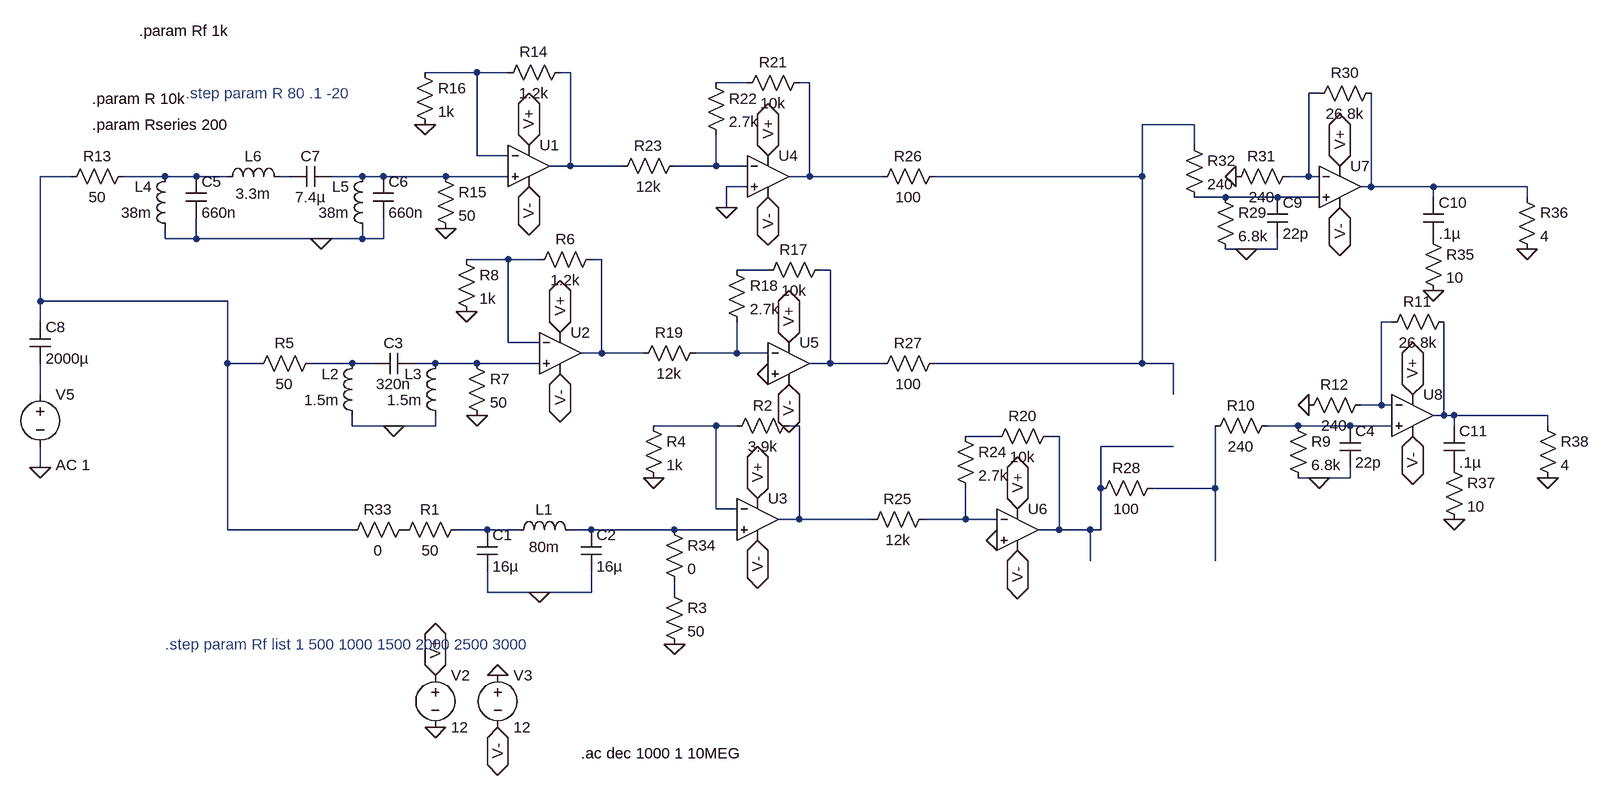
[diagram p0: schematic use_this_for_simulations_on_Mac.asc]
use_this_for_simulations_on_Mac.asc, the LTspice schematic file:
Version 4
SHEET 1 1492 680
WIRE -224 -592 -304 -592
WIRE -176 -592 -224 -592
WIRE -80 -592 -96 -592
WIRE 192 -576 144 -576
WIRE 288 -576 272 -576
WIRE 1072 -560 1056 -560
WIRE 880 -512 800 -512
WIRE 880 -480 880 -512
WIRE -224 -464 -224 -592
WIRE -176 -464 -224 -464
WIRE -80 -448 -80 -592
WIRE -80 -448 -112 -448
WIRE 0 -448 -80 -448
WIRE 144 -448 144 -496
WIRE 144 -448 80 -448
WIRE 192 -448 144 -448
WIRE -848 -432 -896 -432
WIRE -704 -432 -768 -432
WIRE -656 -432 -704 -432
WIRE -608 -432 -656 -432
WIRE -512 -432 -528 -432
WIRE -400 -432 -448 -432
WIRE -368 -432 -400 -432
WIRE -272 -432 -368 -432
WIRE -176 -432 -272 -432
WIRE 288 -432 288 -576
WIRE 288 -432 256 -432
WIRE 400 -432 288 -432
WIRE 800 -432 800 -512
WIRE 800 -432 480 -432
WIRE 1056 -432 1056 -560
WIRE 1056 -432 1024 -432
WIRE 1072 -432 1056 -432
WIRE 192 -416 160 -416
WIRE 1152 -416 1152 -560
WIRE 1152 -416 1136 -416
WIRE 1248 -416 1152 -416
WIRE 1392 -416 1248 -416
WIRE 928 -400 880 -400
WIRE 1008 -400 928 -400
WIRE 1072 -400 1008 -400
WIRE 1248 -400 1248 -416
WIRE 1392 -400 1392 -416
WIRE 160 -384 160 -416
WIRE -704 -336 -704 -352
WIRE -656 -336 -656 -368
WIRE -656 -336 -704 -336
WIRE -464 -336 -656 -336
WIRE -400 -336 -400 -352
WIRE -400 -336 -464 -336
WIRE -368 -336 -368 -368
WIRE -368 -336 -400 -336
WIRE 960 -320 928 -320
WIRE 1008 -320 1008 -336
WIRE 1008 -320 960 -320
WIRE -176 -304 -240 -304
WIRE -128 -304 -176 -304
WIRE -32 -304 -48 -304
WIRE 224 -288 176 -288
WIRE 320 -288 304 -288
WIRE -896 -240 -896 -432
WIRE -608 -240 -896 -240
WIRE -896 -208 -896 -240
WIRE 1184 -208 1168 -208
WIRE -176 -176 -176 -304
WIRE -128 -176 -176 -176
WIRE -32 -160 -32 -304
WIRE -32 -160 -64 -160
WIRE 32 -160 -32 -160
WIRE 176 -160 176 -208
WIRE 176 -160 112 -160
WIRE 224 -160 176 -160
WIRE -608 -144 -608 -240
WIRE -560 -144 -608 -144
WIRE -416 -144 -480 -144
WIRE -384 -144 -416 -144
WIRE -288 -144 -320 -144
WIRE -224 -144 -288 -144
WIRE -128 -144 -224 -144
WIRE 320 -144 320 -288
WIRE 320 -144 288 -144
WIRE 400 -144 320 -144
WIRE 800 -144 800 -432
WIRE 800 -144 480 -144
WIRE 848 -144 800 -144
WIRE -896 -96 -896 -144
WIRE 848 -96 848 -144
WIRE 1168 -80 1168 -208
WIRE 1168 -80 1136 -80
WIRE 1184 -80 1168 -80
WIRE 1264 -64 1264 -208
WIRE 1264 -64 1248 -64
WIRE 1280 -64 1264 -64
WIRE 1424 -64 1280 -64
WIRE -416 -48 -416 -64
WIRE -352 -48 -416 -48
WIRE -288 -48 -288 -64
WIRE -288 -48 -352 -48
WIRE 144 -48 48 -48
WIRE 176 -48 144 -48
WIRE 272 -48 256 -48
WIRE 1040 -48 992 -48
WIRE 1120 -48 1040 -48
WIRE 1184 -48 1120 -48
WIRE 1280 -48 1280 -64
WIRE 1424 -48 1424 -64
WIRE 576 -32 528 -32
WIRE 672 -32 656 -32
WIRE 848 -16 736 -16
WIRE -896 16 -896 -16
WIRE 1072 32 1040 32
WIRE 1120 32 1120 16
WIRE 1120 32 1072 32
WIRE 736 48 736 -16
WIRE 912 48 912 -48
WIRE 912 48 816 48
WIRE 144 80 144 -48
WIRE 176 80 144 80
WIRE 272 96 272 -48
WIRE 272 96 240 96
WIRE 384 96 272 96
WIRE 528 96 528 48
WIRE 528 96 464 96
WIRE 576 96 528 96
WIRE -608 112 -608 -144
WIRE -416 112 -608 112
WIRE -208 112 -256 112
WIRE -160 112 -208 112
WIRE -48 112 -80 112
WIRE 80 112 -48 112
WIRE 176 112 80 112
WIRE 672 112 672 -32
WIRE 672 112 640 112
WIRE 720 112 672 112
WIRE 736 112 736 48
WIRE 736 112 720 112
WIRE 720 160 720 112
WIRE 912 160 912 48
WIRE -208 208 -208 176
WIRE -128 208 -208 208
WIRE -48 208 -48 176
WIRE -48 208 -128 208
WIRE 80 208 80 192
FLAG -288 336 V+
IOPIN -288 336 BiDir
FLAG 208 64 V+
IOPIN 208 64 BiDir
FLAG -192 416 V-
IOPIN -192 416 BiDir
FLAG 208 128 V-
IOPIN 208 128 BiDir
FLAG -192 336 0
FLAG -288 416 0
FLAG -128 208 0
FLAG -352 -48 0
FLAG 1216 -96 V+
IOPIN 1216 -96 BiDir
FLAG 1216 -32 V-
IOPIN 1216 -32 BiDir
FLAG 1072 32 0
FLAG 1056 -80 0
FLAG -896 16 0
FLAG -464 -336 0
FLAG 80 288 0
FLAG -96 -192 V+
IOPIN -96 -192 BiDir
FLAG -96 -128 V-
IOPIN -96 -128 BiDir
FLAG -224 -64 0
FLAG -144 -480 V+
IOPIN -144 -480 BiDir
FLAG -144 -416 V-
IOPIN -144 -416 BiDir
FLAG -272 -352 0
FLAG 224 -464 V+
IOPIN 224 -464 BiDir
FLAG 224 -400 V-
IOPIN 224 -400 BiDir
FLAG 256 -176 V+
IOPIN 256 -176 BiDir
FLAG 256 -112 V-
IOPIN 256 -112 BiDir
FLAG 608 80 V+
IOPIN 608 80 BiDir
FLAG 608 144 V-
IOPIN 608 144 BiDir
FLAG 224 -128 0
FLAG 160 -384 0
FLAG 576 128 0
FLAG 1104 -448 V+
IOPIN 1104 -448 BiDir
FLAG 1104 -384 V-
IOPIN 1104 -384 BiDir
FLAG 960 -320 0
FLAG 944 -432 0
FLAG 1248 -256 0
FLAG 1392 -320 0
FLAG -304 -512 0
FLAG -240 -224 0
FLAG 48 32 0
FLAG 1280 96 0
FLAG 1424 32 0
SYMBOL voltage -288 320 R0
WINDOW 123 0 0 Left 2
WINDOW 39 0 0 Left 2
SYMATTR InstName V2
SYMATTR Value 12
SYMBOL voltage -192 320 R0
WINDOW 123 0 0 Left 2
WINDOW 39 0 0 Left 2
SYMATTR InstName V3
SYMATTR Value 12
SYMBOL res -240 96 R90
WINDOW 0 0 56 VBottom 2
WINDOW 3 32 56 VTop 2
SYMATTR InstName R1
SYMATTR Value 50
SYMBOL res 272 -64 R90
WINDOW 0 0 56 VBottom 2
WINDOW 3 32 56 VTop 2
SYMATTR InstName R2
SYMATTR Value 3.9k
SYMBOL cap -224 112 R0
SYMATTR InstName C1
SYMATTR Value 16µ
SYMBOL ind -176 128 R270
WINDOW 0 32 56 VTop 2
WINDOW 3 5 56 VBottom 2
SYMATTR InstName L1
SYMATTR Value 80m
SYMATTR SpiceLine Rser={Rseries}
SYMBOL cap -64 112 R0
SYMATTR InstName C2
SYMATTR Value 16µ
SYMBOL res 64 192 R0
SYMATTR InstName R3
SYMATTR Value 50
SYMBOL res 32 -64 R0
SYMATTR InstName R4
SYMATTR Value 1k
SYMBOL res -464 -160 R90
WINDOW 0 0 56 VBottom 2
WINDOW 3 32 56 VTop 2
SYMATTR InstName R5
SYMATTR Value 50
SYMBOL cap -384 -128 R270
WINDOW 0 32 32 VTop 2
WINDOW 3 0 32 VBottom 2
SYMATTR InstName C3
SYMATTR Value 320n
SYMBOL ind -400 -48 R180
WINDOW 0 36 80 Left 2
WINDOW 3 36 40 Left 2
SYMATTR InstName L2
SYMATTR Value 1.5m
SYMBOL ind -272 -48 R180
WINDOW 0 36 80 Left 2
WINDOW 3 36 40 Left 2
SYMATTR InstName L3
SYMATTR Value 1.5m
SYMBOL cap 1104 -48 R0
SYMATTR InstName C4
SYMATTR Value 22p
SYMBOL res 1024 -64 R0
SYMATTR InstName R9
SYMATTR Value 6.8k
SYMBOL res 896 -32 R270
WINDOW 0 32 56 VTop 2
WINDOW 3 0 56 VBottom 2
SYMATTR InstName R10
SYMATTR Value 240
SYMBOL res 1168 -192 R270
WINDOW 0 32 56 VTop 2
WINDOW 3 0 56 VBottom 2
SYMATTR InstName R11
SYMATTR Value 26.8k
SYMBOL res 1040 -64 R270
WINDOW 0 32 56 VTop 2
WINDOW 3 0 56 VBottom 2
SYMATTR InstName R12
SYMATTR Value 240
SYMBOL voltage -896 -112 R0
WINDOW 123 24 124 Left 2
WINDOW 39 0 0 Left 2
SYMATTR Value2 AC 1
SYMATTR InstName V5
SYMATTR Value ""
SYMBOL res -752 -448 R90
WINDOW 0 0 56 VBottom 2
WINDOW 3 32 56 VTop 2
SYMATTR InstName R13
SYMATTR Value 50
SYMBOL ind -688 -336 R180
WINDOW 0 36 80 Left 2
WINDOW 3 36 40 Left 2
SYMATTR InstName L4
SYMATTR Value 38m
SYMBOL ind -384 -336 R180
WINDOW 0 36 80 Left 2
WINDOW 3 36 40 Left 2
SYMATTR InstName L5
SYMATTR Value 38m
SYMBOL cap -672 -432 R0
SYMATTR InstName C5
SYMATTR Value 660n
SYMBOL cap -384 -432 R0
SYMATTR InstName C6
SYMATTR Value 660n
SYMBOL ind -624 -416 R270
WINDOW 0 32 56 VTop 2
WINDOW 3 5 56 VBottom 2
SYMATTR InstName L6
SYMATTR Value 3.3m
SYMBOL cap -512 -416 R270
WINDOW 0 32 32 VTop 2
WINDOW 3 0 32 VBottom 2
SYMATTR InstName C7
SYMATTR Value 7.4µ
SYMBOL res -32 -320 R90
WINDOW 0 0 56 VBottom 2
WINDOW 3 32 56 VTop 2
SYMATTR InstName R6
SYMATTR Value 1.2k
SYMBOL res -240 -160 R0
SYMATTR InstName R7
SYMATTR Value 50
SYMBOL res -256 -320 R0
SYMATTR InstName R8
SYMATTR Value 1k
SYMBOL res -80 -608 R90
WINDOW 0 0 56 VBottom 2
WINDOW 3 32 56 VTop 2
SYMATTR InstName R14
SYMATTR Value 1.2k
SYMBOL res -288 -448 R0
SYMATTR InstName R15
SYMATTR Value 50
SYMBOL res -320 -608 R0
SYMATTR InstName R16
SYMATTR Value 1k
SYMBOL res 288 -592 R90
WINDOW 0 0 56 VBottom 2
WINDOW 3 32 56 VTop 2
SYMATTR InstName R21
SYMATTR Value 10k
SYMBOL res 128 -592 R0
SYMATTR InstName R22
SYMATTR Value 2.7k
SYMBOL res -16 -432 R270
WINDOW 0 32 56 VTop 2
WINDOW 3 0 56 VBottom 2
SYMATTR InstName R23
SYMATTR Value 12k
SYMBOL res 320 -304 R90
WINDOW 0 0 56 VBottom 2
WINDOW 3 32 56 VTop 2
SYMATTR InstName R17
SYMATTR Value 10k
SYMBOL res 160 -304 R0
SYMATTR InstName R18
SYMATTR Value 2.7k
SYMBOL res 16 -144 R270
WINDOW 0 32 56 VTop 2
WINDOW 3 0 56 VBottom 2
SYMATTR InstName R19
SYMATTR Value 12k
SYMBOL res 672 -48 R90
WINDOW 0 0 56 VBottom 2
WINDOW 3 32 56 VTop 2
SYMATTR InstName R20
SYMATTR Value 10k
SYMBOL res 512 -48 R0
SYMATTR InstName R24
SYMATTR Value 2.7k
SYMBOL res 368 112 R270
WINDOW 0 32 56 VTop 2
WINDOW 3 0 56 VBottom 2
SYMATTR InstName R25
SYMATTR Value 12k
SYMBOL res 384 -416 R270
WINDOW 0 32 56 VTop 2
WINDOW 3 0 56 VBottom 2
SYMATTR InstName R26
SYMATTR Value 100
SYMBOL res 384 -128 R270
WINDOW 0 32 56 VTop 2
WINDOW 3 0 56 VBottom 2
SYMATTR InstName R27
SYMATTR Value 100
SYMBOL res 720 64 R270
WINDOW 0 32 56 VTop 2
WINDOW 3 0 56 VBottom 2
SYMATTR InstName R28
SYMATTR Value 100
SYMBOL cap -912 -208 R0
SYMATTR InstName C8
SYMATTR Value 2000µ
SYMBOL cap 992 -400 R0
SYMATTR InstName C9
SYMATTR Value 22p
SYMBOL res 912 -416 R0
SYMATTR InstName R29
SYMATTR Value 6.8k
SYMBOL res 1056 -544 R270
WINDOW 0 32 56 VTop 2
WINDOW 3 0 56 VBottom 2
SYMATTR InstName R30
SYMATTR Value 26.8k
SYMBOL res 928 -416 R270
WINDOW 0 32 56 VTop 2
WINDOW 3 0 56 VBottom 2
SYMATTR InstName R31
SYMATTR Value 240
SYMBOL res 864 -496 R0
SYMATTR InstName R32
SYMATTR Value 240
SYMBOL res -320 96 R90
WINDOW 0 0 56 VBottom 2
WINDOW 3 32 56 VTop 2
SYMATTR InstName R33
SYMATTR Value 0
SYMBOL res 64 96 R0
SYMATTR InstName R34
SYMATTR Value 0
SYMBOL cap 1232 -400 R0
SYMATTR InstName C10
SYMATTR Value .1µ
SYMBOL res 1232 -352 R0
SYMATTR InstName R35
SYMATTR Value 10
SYMBOL res 1376 -416 R0
SYMATTR InstName R36
SYMATTR Value 4
SYMBOL cap 1264 -48 R0
SYMATTR InstName C11
SYMATTR Value .1µ
SYMBOL res 1264 0 R0
SYMATTR InstName R37
SYMATTR Value 10
SYMBOL res 1408 -64 R0
SYMATTR InstName R38
SYMATTR Value 4
SYMBOL UniversalOpamp2 -144 -448 R0
SYMATTR InstName U1
SYMBOL UniversalOpamp2 -96 -160 R0
SYMATTR InstName U2
SYMBOL UniversalOpamp2 208 96 R0
SYMATTR InstName U3
SYMBOL UniversalOpamp2 224 -432 R0
SYMATTR InstName U4
SYMBOL UniversalOpamp2 256 -144 R0
SYMATTR InstName U5
SYMBOL UniversalOpamp2 608 112 R0
SYMATTR InstName U6
SYMBOL UniversalOpamp2 1104 -416 R0
SYMATTR InstName U7
SYMBOL UniversalOpamp2 1216 -64 R0
SYMATTR InstName U8
TEXT -64 456 Left 2 !.ac dec 1000 1 10MEG
TEXT -672 -560 Left 2 ;.step param R 80 .1 -20
TEXT -816 -552 Left 2 !.param R 10k
TEXT -816 -512 Left 2 !.param Rseries 200
TEXT -704 288 Left 2 ;.step param Rf list 1 500 1000 1500 2000 2500 3000
TEXT -744 -656 Left 2 !.param Rf 1k

The netlist it stands for:
* use_this_for_simulations_on_Mac.asc
V2 V+ 0 12
V3 0 V- 12
R1 N031 P001 50
R2 N025 N024 3.9k
C1 N031 0 16µ
L1 N031 N032 80m Rser={Rseries}
C2 N032 0 16µ
R3 N033 0 50
R4 N024 0 1k
R5 N020 N008 50
C3 N020 N021 320n
L2 0 N020 1.5m
L3 0 N021 1.5m
C4 N026 0 22p
R9 N026 0 6.8k
R10 N029 N026 240
R11 N018 N023 26.8k
R12 0 N018 240
V5 N022 0 AC 1
R13 N009 N008 50
L4 0 N009 38m
L5 0 N011 38m
C5 N009 0 660n
C6 N011 0 660n
L6 N009 N010 3.3m
C7 N010 N011 7.4µ
R6 N015 N014 1.2k
R7 N021 0 50
R8 N014 0 1k
R14 N002 N001 1.2k
R15 N011 0 50
R16 N001 0 1k
R21 N004 N003 10k
R22 N003 N007 2.7k
R23 N002 N007 12k
R17 N017 N016 10k
R18 N016 N019 2.7k
R19 N015 N019 12k
R20 N028 N027 10k
R24 N027 N030 2.7k
R25 N025 N030 12k
R26 N004 N006 100
R27 N017 N006 100
R28 N028 N029 100
C8 N008 N022 2000µ
C9 N013 0 22p
R29 N013 0 6.8k
R30 N005 N012 26.8k
R31 0 N005 240
R32 N006 N013 240
R33 P001 N008 0
R34 N032 N033 0
C10 N012 P002 .1µ
R35 P002 0 10
R36 N012 0 4
C11 N023 P003 .1µ
R37 P003 0 10
R38 N023 0 4
XU1 N011 N001 V+ V- N002 level.2 Avol=1Meg GBW=10Meg Slew=10Meg ilimit=25m rail=0 Vos=0 phimargin=45 en=0 enk=0 in=0 ink=0 Rin=500Meg  ; pins IN+ IN- V+ V- OUT
XU2 N021 N014 V+ V- N015 level.2 Avol=1Meg GBW=10Meg Slew=10Meg ilimit=25m rail=0 Vos=0 phimargin=45 en=0 enk=0 in=0 ink=0 Rin=500Meg  ; pins IN+ IN- V+ V- OUT
XU3 N032 N024 V+ V- N025 level.2 Avol=1Meg GBW=10Meg Slew=10Meg ilimit=25m rail=0 Vos=0 phimargin=45 en=0 enk=0 in=0 ink=0 Rin=500Meg  ; pins IN+ IN- V+ V- OUT
XU4 0 N007 V+ V- N004 level.2 Avol=1Meg GBW=10Meg Slew=10Meg ilimit=25m rail=0 Vos=0 phimargin=45 en=0 enk=0 in=0 ink=0 Rin=500Meg  ; pins IN+ IN- V+ V- OUT
XU5 0 N019 V+ V- N017 level.2 Avol=1Meg GBW=10Meg Slew=10Meg ilimit=25m rail=0 Vos=0 phimargin=45 en=0 enk=0 in=0 ink=0 Rin=500Meg  ; pins IN+ IN- V+ V- OUT
XU6 0 N030 V+ V- N028 level.2 Avol=1Meg GBW=10Meg Slew=10Meg ilimit=25m rail=0 Vos=0 phimargin=45 en=0 enk=0 in=0 ink=0 Rin=500Meg  ; pins IN+ IN- V+ V- OUT
XU7 N013 N005 V+ V- N012 level.2 Avol=1Meg GBW=10Meg Slew=10Meg ilimit=25m rail=0 Vos=0 phimargin=45 en=0 enk=0 in=0 ink=0 Rin=500Meg  ; pins IN+ IN- V+ V- OUT
XU8 N026 N018 V+ V- N023 level.2 Avol=1Meg GBW=10Meg Slew=10Meg ilimit=25m rail=0 Vos=0 phimargin=45 en=0 enk=0 in=0 ink=0 Rin=500Meg  ; pins IN+ IN- V+ V- OUT
.ac dec 1000 1 10MEG
* .step param R 80 .1 -20
.param R 10k
.param Rseries 200
* .step param Rf list 1 500 1000 1500 2000 2500 3000
.param Rf 1k
.lib UniversalOpamps2.sub
.backanno
.end